# Altium schematic sheet GR740_Power.SchDoc
size A3
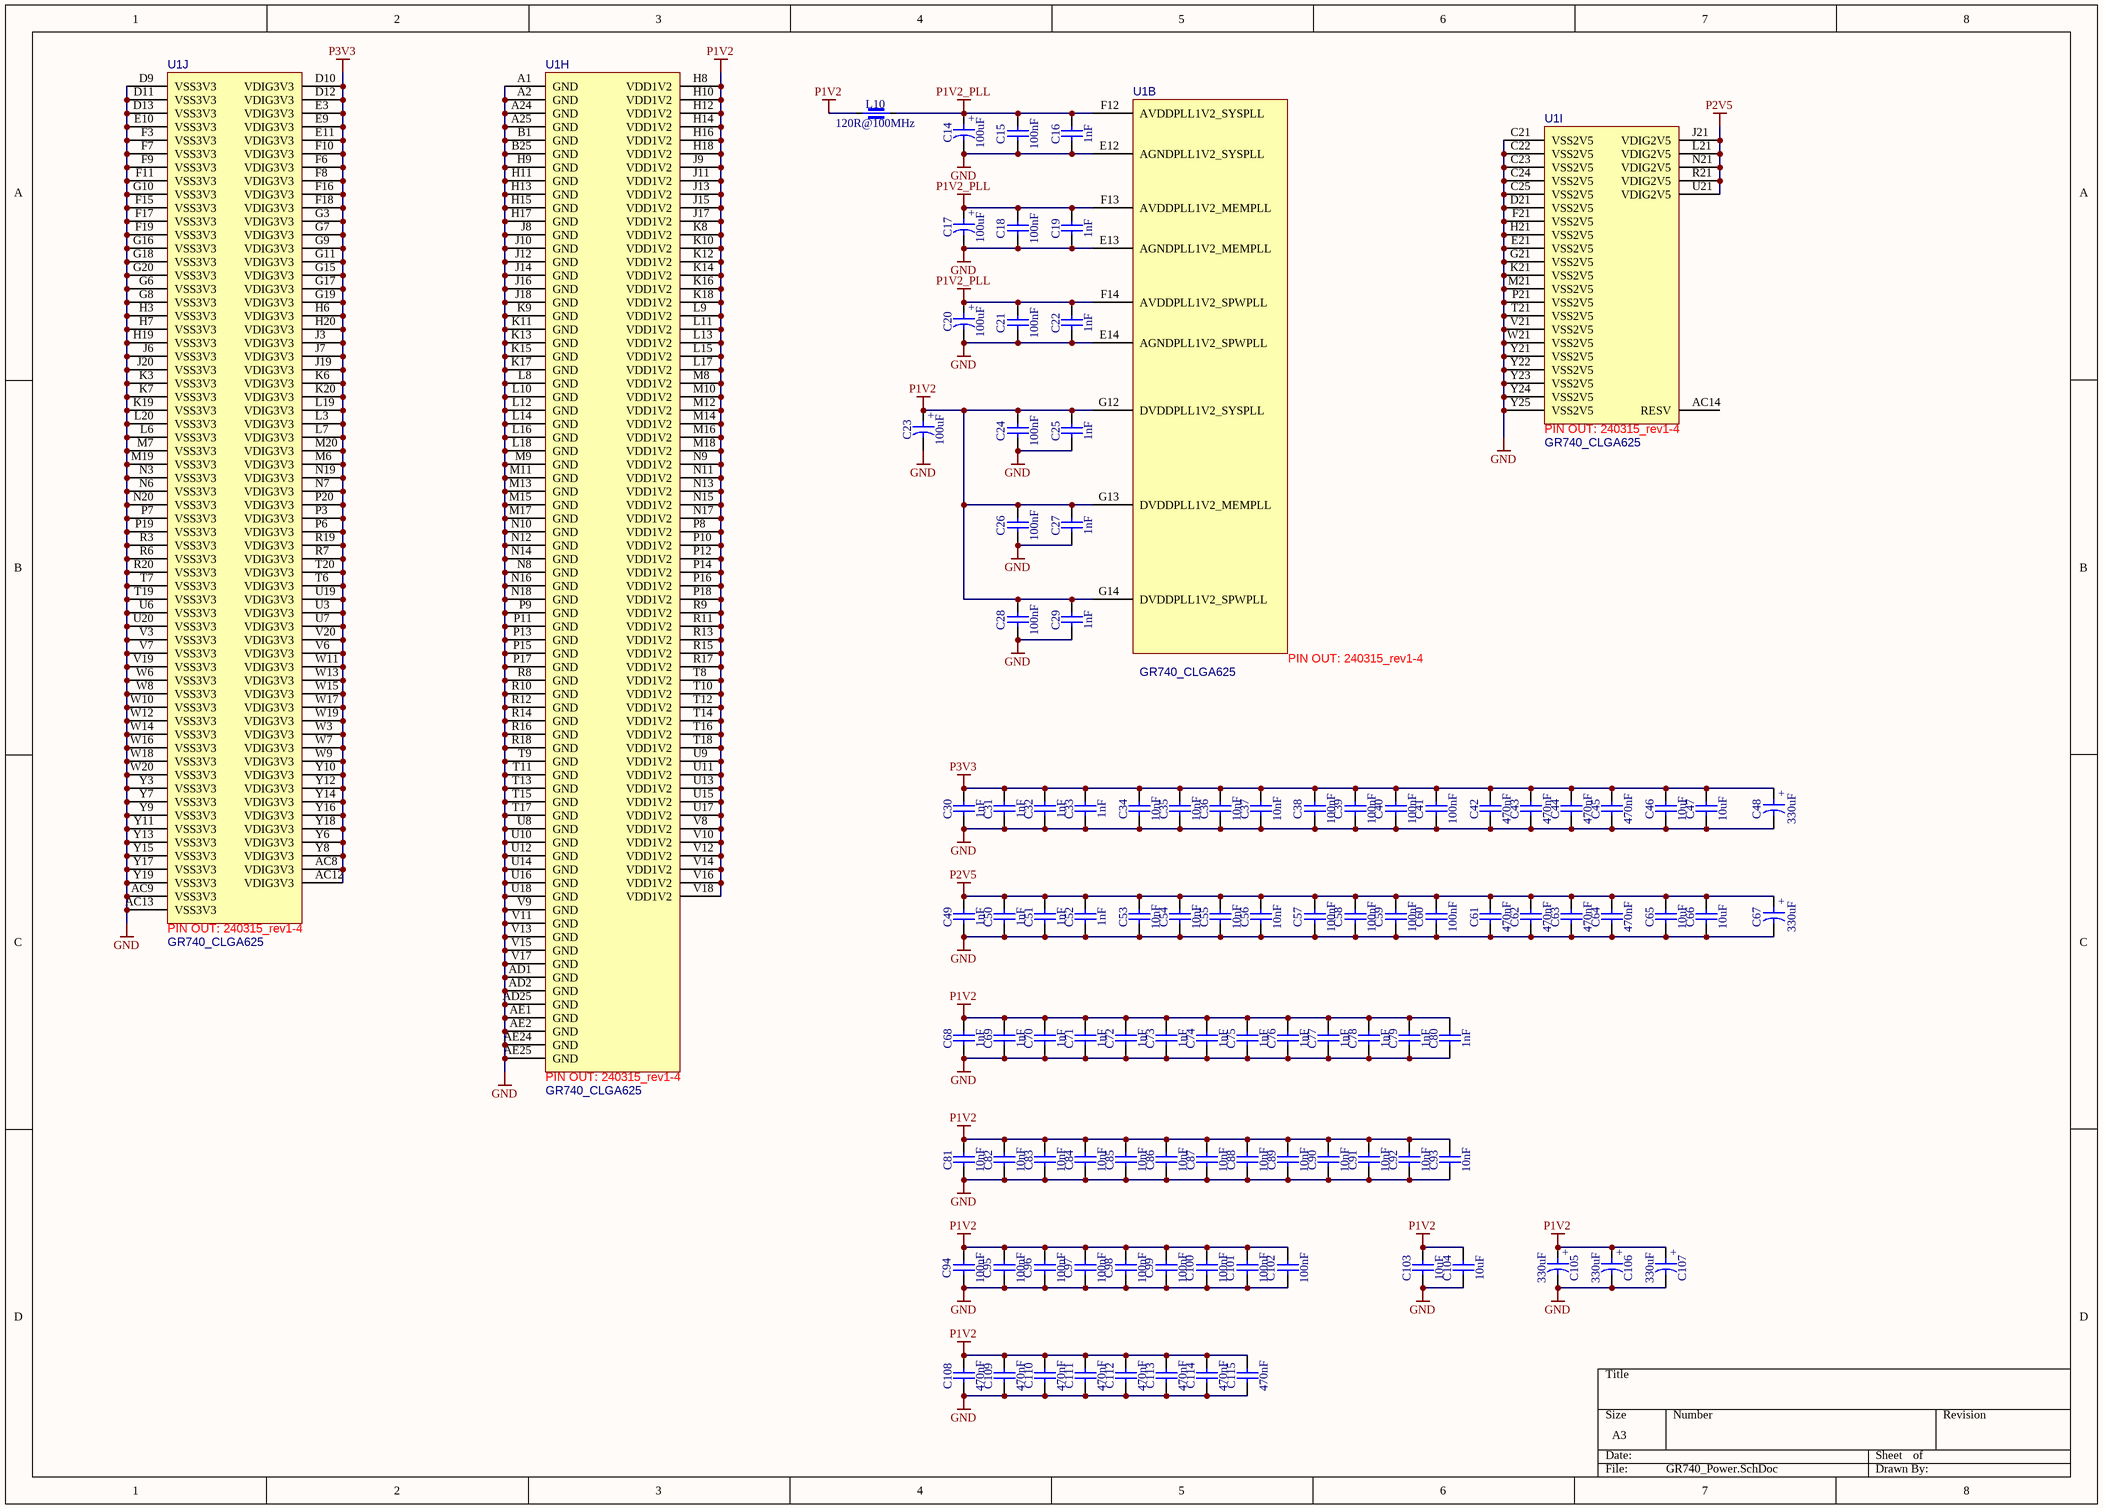
[diagram p0: GR740_Power.SchDoc]

## Parts
C14  100uF  [CAPMP3528X210N]
C15  100nF  [CAPC0603X33N]
C16  1nF  [CAPC0603X33N]
C17  100uF  [CAPMP3528X210N]
C18  100nF  [CAPC0603X33N]
C19  1nF  [CAPC0603X33N]
C20  100uF  [CAPMP3528X210N]
C21  100nF  [CAPC0603X33N]
C22  1nF  [CAPC0603X33N]
C23  100uF  [CAPMP3528X210N]
C24  100nF  [CAPC0603X33N]
C25  1nF  [CAPC0603X33N]
C26  100nF  [CAPC0603X33N]
C27  1nF  [CAPC0603X33N]
C28  100nF  [CAPC0603X33N]
C29  1nF  [CAPC0603X33N]
C30  1nF  [CAPC0603X33N]
C31  1nF  [CAPC0603X33N]
C32  1nF  [CAPC0603X33N]
C33  1nF  [CAPC0603X33N]
C34  10nF  [CAPC0603X33N]
C35  10nF  [CAPC0603X33N]
C36  10nF  [CAPC0603X33N]
C37  10nF  [CAPC0603X33N]
C38  100nF  [CAPC0603X33N]
C39  100nF  [CAPC0603X33N]
C40  100nF  [CAPC0603X33N]
C41  100nF  [CAPC0603X33N]
C42  470nF  [CAPC0603X33N]
C43  470nF  [CAPC0603X33N]
C44  470nF  [CAPC0603X33N]
C45  470nF  [CAPC0603X33N]
C46  10uF  [CAPC2012X135N]
C47  10uF  [CAPC2012X135N]
C48  330uF  [CAPMP7343X310N]
C49  1nF  [CAPC0603X33N]
C50  1nF  [CAPC0603X33N]
C51  1nF  [CAPC0603X33N]
C52  1nF  [CAPC0603X33N]
C53  10nF  [CAPC0603X33N]
C54  10nF  [CAPC0603X33N]
C55  10nF  [CAPC0603X33N]
C56  10nF  [CAPC0603X33N]
C57  100nF  [CAPC0603X33N]
C58  100nF  [CAPC0603X33N]
C59  100nF  [CAPC0603X33N]
C60  100nF  [CAPC0603X33N]
C61  470nF  [CAPC0603X33N]
C62  470nF  [CAPC0603X33N]
C63  470nF  [CAPC0603X33N]
C64  470nF  [CAPC0603X33N]
C65  10uF  [CAPC2012X135N]
C66  10uF  [CAPC2012X135N]
C67  330uF  [CAPMP7343X310N]
C68  1nF  [CAPC0603X33N]
C69  1nF  [CAPC0603X33N]
C70  1nF  [CAPC0603X33N]
C71  1nF  [CAPC0603X33N]
C72  1nF  [CAPC0603X33N]
C73  1nF  [CAPC0603X33N]
C74  1nF  [CAPC0603X33N]
C75  1nF  [CAPC0603X33N]
C76  1nF  [CAPC0603X33N]
C77  1nF  [CAPC0603X33N]
C78  1nF  [CAPC0603X33N]
C79  1nF  [CAPC0603X33N]
C80  1nF  [CAPC0603X33N]
C81  10nF  [CAPC0603X33N]
C82  10nF  [CAPC0603X33N]
C83  10nF  [CAPC0603X33N]
C84  10nF  [CAPC0603X33N]
C85  10nF  [CAPC0603X33N]
C86  10nF  [CAPC0603X33N]
C87  10nF  [CAPC0603X33N]
C88  10nF  [CAPC0603X33N]
C89  10nF  [CAPC0603X33N]
C90  10nF  [CAPC0603X33N]
C91  10nF  [CAPC0603X33N]
C92  10nF  [CAPC0603X33N]
C93  10nF  [CAPC0603X33N]
C94  100nF  [CAPC0603X33N]
C95  100nF  [CAPC0603X33N]
C96  100nF  [CAPC0603X33N]
C97  100nF  [CAPC0603X33N]
C98  100nF  [CAPC0603X33N]
C99  100nF  [CAPC0603X33N]
C100  100nF  [CAPC0603X33N]
C101  100nF  [CAPC0603X33N]
C102  100nF  [CAPC0603X33N]
C103  10uF  [CAPC2012X135N]
C104  10uF  [CAPC2012X135N]
C105  330uF  [CAPMP7343X190N]
C106  330uF  [CAPMP7343X190N]
C107  330uF  [CAPMP7343X190N]
C108  470nF  [CAPC0603X33N]
C109  470nF  [CAPC0603X33N]
C110  470nF  [CAPC0603X33N]
C111  470nF  [CAPC0603X33N]
C112  470nF  [CAPC0603X33N]
C113  470nF  [CAPC0603X33N]
C114  470nF  [CAPC0603X33N]
C115  470nF  [CAPC0603X33N]
L10  120R@100MHz  [INDC1005X55N]
U1  GR740_CLGA625  [BGA625C100P25X25_3182X3182X1543]  (parts B,H,I,J of 10)

## Nets
GND: C14.2 C15.2 C16.1 C17.2 C18.2 C19.1 C20.2 C21.2 C22.1 C23.2 C24.2 C25.1 C26.2 C27.1 C28.2 C29.1 C30.1 C31.1 C32.1 C33.1 C34.1 C35.1 C36.1 C37.1 C38.2 C39.2 C40.2 C41.2 C42.1 C43.1 C44.1 C45.1 C46.1 C47.1 C48.2 C49.1 C50.1 C51.1 C52.1 C53.1 C54.1 C55.1 C56.1 C57.2 C58.2 C59.2 C60.2 C61.1 C62.1 C63.1 C64.1 C65.1 C66.1 C67.2 C68.1 C69.1 C70.1 C71.1 C72.1 C73.1 C74.1 C75.1 C76.1 C77.1 C78.1 C79.1 C80.1 C81.1 C82.1 C83.1 C84.1 C85.1 C86.1 C87.1 C88.1 C89.1 C90.1 C91.1 C92.1 C93.1 C94.2 C95.2 C96.2 C97.2 C98.2 C99.2 C100.2 C101.2 C102.2 C103.1 C104.1 C105.2 C106.2 C107.2 C108.1 C109.1 C110.1 C111.1 C112.1 C113.1 C114.1 C115.1 U1.A1(GND) U1.A2(GND) U1.A24(GND) U1.A25(GND) U1.AC9(VSS3V3) U1.AC13(VSS3V3) U1.AD1(GND) U1.AD2(GND) U1.AD25(GND) U1.AE1(GND) U1.AE2(GND) U1.AE24(GND) U1.AE25(GND) U1.B1(GND) U1.B25(GND) U1.C21(VSS2V5) U1.C22(VSS2V5) U1.C23(VSS2V5) U1.C24(VSS2V5) U1.C25(VSS2V5) U1.D9(VSS3V3) U1.D11(VSS3V3) U1.D13(VSS3V3) U1.D21(VSS2V5) U1.E10(VSS3V3) U1.E12(AGNDPLL1V2_SYSPLL) U1.E13(AGNDPLL1V2_MEMPLL) U1.E14(AGNDPLL1V2_SPWPLL) U1.E21(VSS2V5) U1.F3(VSS3V3) U1.F7(VSS3V3) U1.F9(VSS3V3) U1.F11(VSS3V3) U1.F15(VSS3V3) U1.F17(VSS3V3) U1.F19(VSS3V3) U1.F21(VSS2V5) U1.G6(VSS3V3) U1.G8(VSS3V3) U1.G10(VSS3V3) U1.G16(VSS3V3) U1.G18(VSS3V3) U1.G20(VSS3V3) U1.G21(VSS2V5) U1.H3(VSS3V3) U1.H7(VSS3V3) U1.H9(GND) U1.H11(GND) U1.H13(GND) U1.H15(GND) U1.H17(GND) U1.H19(VSS3V3) U1.H21(VSS2V5) U1.J6(VSS3V3) U1.J8(GND) U1.J10(GND) U1.J12(GND) U1.J14(GND) U1.J16(GND) U1.J18(GND) U1.J20(VSS3V3) U1.K3(VSS3V3) U1.K7(VSS3V3) U1.K9(GND) U1.K11(GND) U1.K13(GND) U1.K15(GND) U1.K17(GND) U1.K19(VSS3V3) U1.K21(VSS2V5) U1.L6(VSS3V3) U1.L8(GND) U1.L10(GND) U1.L12(GND) U1.L14(GND) U1.L16(GND) U1.L18(GND) U1.L20(VSS3V3) U1.M7(VSS3V3) U1.M9(GND) U1.M11(GND) U1.M13(GND) U1.M15(GND) U1.M17(GND) U1.M19(VSS3V3) U1.M21(VSS2V5) U1.N3(VSS3V3) U1.N6(VSS3V3) U1.N8(GND) U1.N10(GND) U1.N12(GND) U1.N14(GND) U1.N16(GND) U1.N18(GND) U1.N20(VSS3V3) U1.P7(VSS3V3) U1.P9(GND) U1.P11(GND) U1.P13(GND) U1.P15(GND) U1.P17(GND) U1.P19(VSS3V3) U1.P21(VSS2V5) U1.R3(VSS3V3) U1.R6(VSS3V3) U1.R8(GND) U1.R10(GND) U1.R12(GND) U1.R14(GND) U1.R16(GND) U1.R18(GND) U1.R20(VSS3V3) U1.T7(VSS3V3) U1.T9(GND) U1.T11(GND) U1.T13(GND) U1.T15(GND) U1.T17(GND) U1.T19(VSS3V3) U1.T21(VSS2V5) U1.U6(VSS3V3) U1.U8(GND) U1.U10(GND) U1.U12(GND) U1.U14(GND) U1.U16(GND) U1.U18(GND) U1.U20(VSS3V3) U1.V3(VSS3V3) U1.V7(VSS3V3) U1.V9(GND) U1.V11(GND) U1.V13(GND) U1.V15(GND) U1.V17(GND) U1.V19(VSS3V3) U1.V21(VSS2V5) U1.W6(VSS3V3) U1.W8(VSS3V3) U1.W10(VSS3V3) U1.W12(VSS3V3) U1.W14(VSS3V3) U1.W16(VSS3V3) U1.W18(VSS3V3) U1.W20(VSS3V3) U1.W21(VSS2V5) U1.Y3(VSS3V3) U1.Y7(VSS3V3) U1.Y9(VSS3V3) U1.Y11(VSS3V3) U1.Y13(VSS3V3) U1.Y15(VSS3V3) U1.Y17(VSS3V3) U1.Y19(VSS3V3) U1.Y21(VSS2V5) U1.Y22(VSS2V5) U1.Y23(VSS2V5) U1.Y24(VSS2V5) U1.Y25(VSS2V5)
P1V2: C23.1 C24.1 C25.2 C26.1 C27.2 C28.1 C29.2 C68.2 C69.2 C70.2 C71.2 C72.2 C73.2 C74.2 C75.2 C76.2 C77.2 C78.2 C79.2 C80.2 C81.2 C82.2 C83.2 C84.2 C85.2 C86.2 C87.2 C88.2 C89.2 C90.2 C91.2 C92.2 C93.2 C94.1 C95.1 C96.1 C97.1 C98.1 C99.1 C100.1 C101.1 C102.1 C103.2 C104.2 C105.1 C106.1 C107.1 C108.2 C109.2 C110.2 C111.2 C112.2 C113.2 C114.2 C115.2 L10.1 U1.G12(DVDDPLL1V2_SYSPLL) U1.G13(DVDDPLL1V2_MEMPLL) U1.G14(DVDDPLL1V2_SPWPLL) U1.H8(VDD1V2) U1.H10(VDD1V2) U1.H12(VDD1V2) U1.H14(VDD1V2) U1.H16(VDD1V2) U1.H18(VDD1V2) U1.J9(VDD1V2) U1.J11(VDD1V2) U1.J13(VDD1V2) U1.J15(VDD1V2) U1.J17(VDD1V2) U1.K8(VDD1V2) U1.K10(VDD1V2) U1.K12(VDD1V2) U1.K14(VDD1V2) U1.K16(VDD1V2) U1.K18(VDD1V2) U1.L9(VDD1V2) U1.L11(VDD1V2) U1.L13(VDD1V2) U1.L15(VDD1V2) U1.L17(VDD1V2) U1.M8(VDD1V2) U1.M10(VDD1V2) U1.M12(VDD1V2) U1.M14(VDD1V2) U1.M16(VDD1V2) U1.M18(VDD1V2) U1.N9(VDD1V2) U1.N11(VDD1V2) U1.N13(VDD1V2) U1.N15(VDD1V2) U1.N17(VDD1V2) U1.P8(VDD1V2) U1.P10(VDD1V2) U1.P12(VDD1V2) U1.P14(VDD1V2) U1.P16(VDD1V2) U1.P18(VDD1V2) U1.R9(VDD1V2) U1.R11(VDD1V2) U1.R13(VDD1V2) U1.R15(VDD1V2) U1.R17(VDD1V2) U1.T8(VDD1V2) U1.T10(VDD1V2) U1.T12(VDD1V2) U1.T14(VDD1V2) U1.T16(VDD1V2) U1.T18(VDD1V2) U1.U9(VDD1V2) U1.U11(VDD1V2) U1.U13(VDD1V2) U1.U15(VDD1V2) U1.U17(VDD1V2) U1.V8(VDD1V2) U1.V10(VDD1V2) U1.V12(VDD1V2) U1.V14(VDD1V2) U1.V16(VDD1V2) U1.V18(VDD1V2)
P1V2_PLL: C14.1 C15.1 C16.2 C17.1 C18.1 C19.2 C20.1 C21.1 C22.2 L10.2 U1.F12(AVDDPLL1V2_SYSPLL) U1.F13(AVDDPLL1V2_MEMPLL) U1.F14(AVDDPLL1V2_SPWPLL)
P2V5: C49.2 C50.2 C51.2 C52.2 C53.2 C54.2 C55.2 C56.2 C57.1 C58.1 C59.1 C60.1 C61.2 C62.2 C63.2 C64.2 C65.2 C66.2 C67.1 U1.J21(VDIG2V5) U1.L21(VDIG2V5) U1.N21(VDIG2V5) U1.R21(VDIG2V5) U1.U21(VDIG2V5)
P3V3: C30.2 C31.2 C32.2 C33.2 C34.2 C35.2 C36.2 C37.2 C38.1 C39.1 C40.1 C41.1 C42.2 C43.2 C44.2 C45.2 C46.2 C47.2 C48.1 U1.AC8(VDIG3V3) U1.AC12(VDIG3V3) U1.D10(VDIG3V3) U1.D12(VDIG3V3) U1.E3(VDIG3V3) U1.E9(VDIG3V3) U1.E11(VDIG3V3) U1.F6(VDIG3V3) U1.F8(VDIG3V3) U1.F10(VDIG3V3) U1.F16(VDIG3V3) U1.F18(VDIG3V3) U1.G3(VDIG3V3) U1.G7(VDIG3V3) U1.G9(VDIG3V3) U1.G11(VDIG3V3) U1.G15(VDIG3V3) U1.G17(VDIG3V3) U1.G19(VDIG3V3) U1.H6(VDIG3V3) U1.H20(VDIG3V3) U1.J3(VDIG3V3) U1.J7(VDIG3V3) U1.J19(VDIG3V3) U1.K6(VDIG3V3) U1.K20(VDIG3V3) U1.L3(VDIG3V3) U1.L7(VDIG3V3) U1.L19(VDIG3V3) U1.M6(VDIG3V3) U1.M20(VDIG3V3) U1.N7(VDIG3V3) U1.N19(VDIG3V3) U1.P3(VDIG3V3) U1.P6(VDIG3V3) U1.P20(VDIG3V3) U1.R7(VDIG3V3) U1.R19(VDIG3V3) U1.T6(VDIG3V3) U1.T20(VDIG3V3) U1.U3(VDIG3V3) U1.U7(VDIG3V3) U1.U19(VDIG3V3) U1.V6(VDIG3V3) U1.V20(VDIG3V3) U1.W3(VDIG3V3) U1.W7(VDIG3V3) U1.W9(VDIG3V3) U1.W11(VDIG3V3) U1.W13(VDIG3V3) U1.W15(VDIG3V3) U1.W17(VDIG3V3) U1.W19(VDIG3V3) U1.Y6(VDIG3V3) U1.Y8(VDIG3V3) U1.Y10(VDIG3V3) U1.Y12(VDIG3V3) U1.Y14(VDIG3V3) U1.Y16(VDIG3V3) U1.Y18(VDIG3V3)

Not connected (* = marked no-connect by the designer): U1 AC14(RESV)

## Notes on the sheet
- (in symbol CTE3528-21_100UF_6.3V_10%) +
- (in symbol CTE7343-19_330UF_2.5V_20%_LESR0025_KEMET_T520) +
- (in symbol CTE7343-31_330UF_6.3V_20%_LESR0025_KEMET_T520) +
- (in symbol GR740_CLGA625, part B) PIN OUT: 240315_rev1-4
- (in symbol GR740_CLGA625, part H) PIN OUT: 240315_rev1-4
- (in symbol GR740_CLGA625, part I) PIN OUT: 240315_rev1-4
- (in symbol GR740_CLGA625, part J) PIN OUT: 240315_rev1-4

## Library data of the parts
C14 C17 C20 C23 = CTE3528-21_100UF_6.3V_10%: Polarised capacitor; Part Description: Solid Tantalum Chip Capacitor; Manufacturer: GENERIC; Manufacturer1 Part Number: TAJB107K006R; Voltage: 6.3V; Tolerance: ±10%; Part Number: CTE3528-21_100UF_6.3V_10%; Component Kind: Standard; Component Type: Standard; Pin Count: 2; Value: 100uF; Status: Preferred; Manufacturer Part Number: CTE3528-21_100UF_6.3V_10%; Case: B; Mounted: Yes; Socket: No; SMD: Yes; Sense: No; HelpURL: \\cern.ch\dfs\Applications\Altium\Datasheets\CTE_AVX_TAJ.pdf; Author: CERN DEM JLC; CreateDate: 03.12.2007; LatestRevisionDate: 03.12.2007; Manufacturer1 Example: AVX; Manufacturer1 ComponentHeight: 2.1mm
C15 C18 C21 C24 C26 C28 C38-C41 C57-C60 C94-C102 = CC0201_100NF_6.3V_10%_X5R: Non-polarised capacitor; Manufacturer: GENERIC; Part Description: SMD Multilayer Chip Ceramic Capacitor; Manufacturer1 Part Number: 02016D104KAT2A; Voltage: 6.3V; TC: X5R; Tolerance: ±10%; Part Number: CC0201_100NF_6.3V_10%_X5R; Component Kind: Standard; Component Type: Standard; Pin Count: 2; Value: 100nF; Status: Not Recommended; Manufacturer Part Number: CC0201_100NF_6.3V_10%_X5R; Case: 0201; Mounted: Yes; Socket: No; SMD: Yes; Sense: No; Manufacturer1 Example: AVX; Manufacturer1 ComponentHeight: 0.33mm; HelpURL: \\cern.ch\dfs\Applications\Altium\Datasheets\CC0201_X5R_AVX.pdf; Author: CERN DEM JLC; CreateDate: 03/12/2007; LatestRevisionDate: 03/12/2007
C16 C19 C22 C25 C27 C29-C33 C49-C52 C68-C80 = CC0201_1NF_16V_10%_X5R: Non-polarised capacitor; Part Description: SMD Multilayer Chip Ceramic Capacitor; Manufacturer: GENERIC; Manufacturer1 Part Number: 0201YD102KAT2A; Voltage: 16V; TC: X5R; Tolerance: ±10%; Part Number: CC0201_1NF_16V_10%_X5R; Component Kind: Standard; Component Type: Standard; Pin Count: 2; Value: 1nF; Status: Not Recommended; Manufacturer Part Number: CC0201_1NF_16V_10%_X5R; Case: 0201; Mounted: Yes; Socket: No; SMD: Yes; Sense: No; Manufacturer1 Example: AVX; Manufacturer1 ComponentHeight: 0.33mm; HelpURL: \\cern.ch\dfs\Applications\Altium\Datasheets\CC0201_X5R_AVX.pdf; Author: CERN DEM JLC; CreateDate: 03.12.2007; LatestRevisionDate: 03.12.2007
C34-C37 C53-C56 C81-C93 = CC0201_10NF_10V_10%_X5R: Non-polarised capacitor; Part Description: SMD Multilayer Chip Ceramic Capacitor; Manufacturer: GENERIC; Manufacturer1 Part Number: 0201ZD103KAT2A; Voltage: 10V; TC: X5R; Tolerance: ±10%; Part Number: CC0201_10NF_10V_10%_X5R; Component Kind: Standard; Component Type: Standard; Pin Count: 2; Value: 10nF; Status: Not Recommended; Manufacturer Part Number: CC0201_10NF_10V_10%_X5R; Case: 0201; Mounted: Yes; Socket: No; SMD: Yes; Sense: No; Manufacturer1 Example: AVX; Manufacturer1 ComponentHeight: 0.33mm; HelpURL: \\cern.ch\dfs\Applications\Altium\Datasheets\CC0201_X5R_AVX.pdf; Author: CERN DEM JLC; CreateDate: 03.12.2007; LatestRevisionDate: 03.12.2007
C42-C45 C61-C64 C108-C115 = CC0201_470NF_4V_20%_X5R: Non-polarised capacitor; Part Description: SMD Multilayer Chip Ceramic Capacitor; Manufacturer: GENERIC; Manufacturer1 Part Number: AMK063BJ474MP-F; Voltage: 4V; TC: X5R; Tolerance: ±20%; Part Number: CC0201_470NF_4V_20%_X5R; Component Kind: Standard; Component Type: Standard; Pin Count: 2; Value: 470nF; Status: Not Recommended; Manufacturer Part Number: CC0201_470NF_4V_20%_X5R; Case: 0201; Mounted: Yes; Socket: No; SMD: Yes; Sense: No; Manufacturer1 Example: TAIYO YUDEN; Manufacturer1 ComponentHeight: 0.33mm; HelpURL: \\cern.ch\dfs\Applications\Altium\Datasheets\CC0201_X5R_TAIYO-YUDEN_STANDARD-CLASS2.pdf; Author: CERN DEM JLC; CreateDate: 27.05.2010; LatestRevisionDate: 27.05.2010
C46 C47 C65 C66 C103 C104 = CC0805_10UF_16V_10%_X5R: Non-polarised capacitor; Part Description: SMD Multilayer Chip Ceramic Capacitor; Manufacturer: GENERIC; Manufacturer1 Part Number: C0805C106K4PAC; Voltage: 16V; TC: X5R; Tolerance: ±10%; Part Number: CC0805_10UF_16V_10%_X5R; Component Kind: Standard; Component Type: Standard; Pin Count: 2; Value: 10uF; Status: Preferred; Manufacturer Part Number: CC0805_10UF_16V_10%_X5R; Case: 0805; Mounted: Yes; Socket: No; SMD: Yes; Sense: No; Manufacturer1 Example: KEMET; Manufacturer1 ComponentHeight: 1.4mm; HelpURL: \\cern.ch\dfs\Applications\Altium\Datasheets\CC1206_X5R_KEMET.pdf; Author: CERN DEM JLC; CreateDate: 03.12.2007; LatestRevisionDate: 03.12.2007
C48 C67 = CTE7343-31_330UF_6.3V_20%_LESR0025_KEMET_T520: Polarised capacitor; Manufacturer: KEMET; Part Description: Low ESR 0R025 Tantalum Chip Capacitor; Manufacturer Part Number: T520D337M006ATE025; Voltage: 6.3V; Tolerance: ±20%; Part Number: CTE7343-31_330UF_6.3V_20%_LESR0025_KEMET_T520; Component Kind: Standard; Component Type: Standard; Pin Count: 2; Value: 330uF; Status: None; Case: D; Mounted: Yes; Socket: No; SMD: Yes; Sense: No; ComponentHeight: 3.1mm; HelpURL: \\cern.ch\dfs\Applications\Altium\Datasheets\CTE-LESR_KEMET_T520.pdf; Author: CERN DEM JLC; CreateDate: 20/10/2010; LatestRevisionDate: 20/10/2010
C105-C107 = CTE7343-19_330UF_2.5V_20%_LESR0025_KEMET_T520: Polarised capacitor; Manufacturer: KEMET; Part Description: Low ESR 0R025 Tantalum Chip Capacitor; Manufacturer Part Number: T520V337M2R5ATE025; Voltage: 2.5V; Tolerance: ±20%; Part Number: CTE7343-19_330UF_2.5V_20%_LESR0025_KEMET_T520; Component Kind: Standard; Component Type: Standard; Pin Count: 2; Value: 330uF; Status: None; Case: V; Mounted: Yes; Socket: No; SMD: Yes; Sense: No; ComponentHeight: 1.9mm; HelpURL: \\cern.ch\dfs\Applications\Altium\Datasheets\CTE-LESR_KEMET_T520.pdf; Author: CERN DEM MR; CreateDate: 23.03.2016; LatestRevisionDate: 23.03.2016
L10 = IND0402_MURATA_BLM15PX121SN1D: Part Description: SMD EMIFIL Chip Ferrite Bead; Manufacturer: MURATA; Power: 2A; Resistance: 0.055R; Tolerance: ±25%; Part Number: IND0402_MURATA_BLM15PX121SN1D; Component Kind: Standard; Component Type: Standard; Pin Count: 2; Value: 120R@100MHz; Status: None; Manufacturer Part Number: BLM15PX121SN1D; Case: 0402; Mounted: Yes; Socket: No; SMD: Yes; Sense: No; ComponentHeight: 0.55mm; HelpURL: \\cern.ch\dfs\Applications\Altium\Datasheets\IND0402_MURATA_BLM15PX.pdf; Author: CERN DEM JMW; CreateDate: 19.02.2014; LatestRevisionDate: 25.10.2018
U1 = GR740_CLGA625: Category: IC; Technology: SMD